# EAGLE design esp32_adapter_05 (EAGLE 7.7.0)
MaxAir - Smart Heating, Ventilation and Air Conditioning (HVAC) Wi-Fi Smart Home Gateway based on MySensors library WT21ETH01 and nRF24L01 PA LNA Note: Power supplied by Barrel Jack connector with minimum 2amp for better performance. Power by micro USB isnt avaialble in this version. For more information on PiHome Smart Heating: http://www.pihome.eu
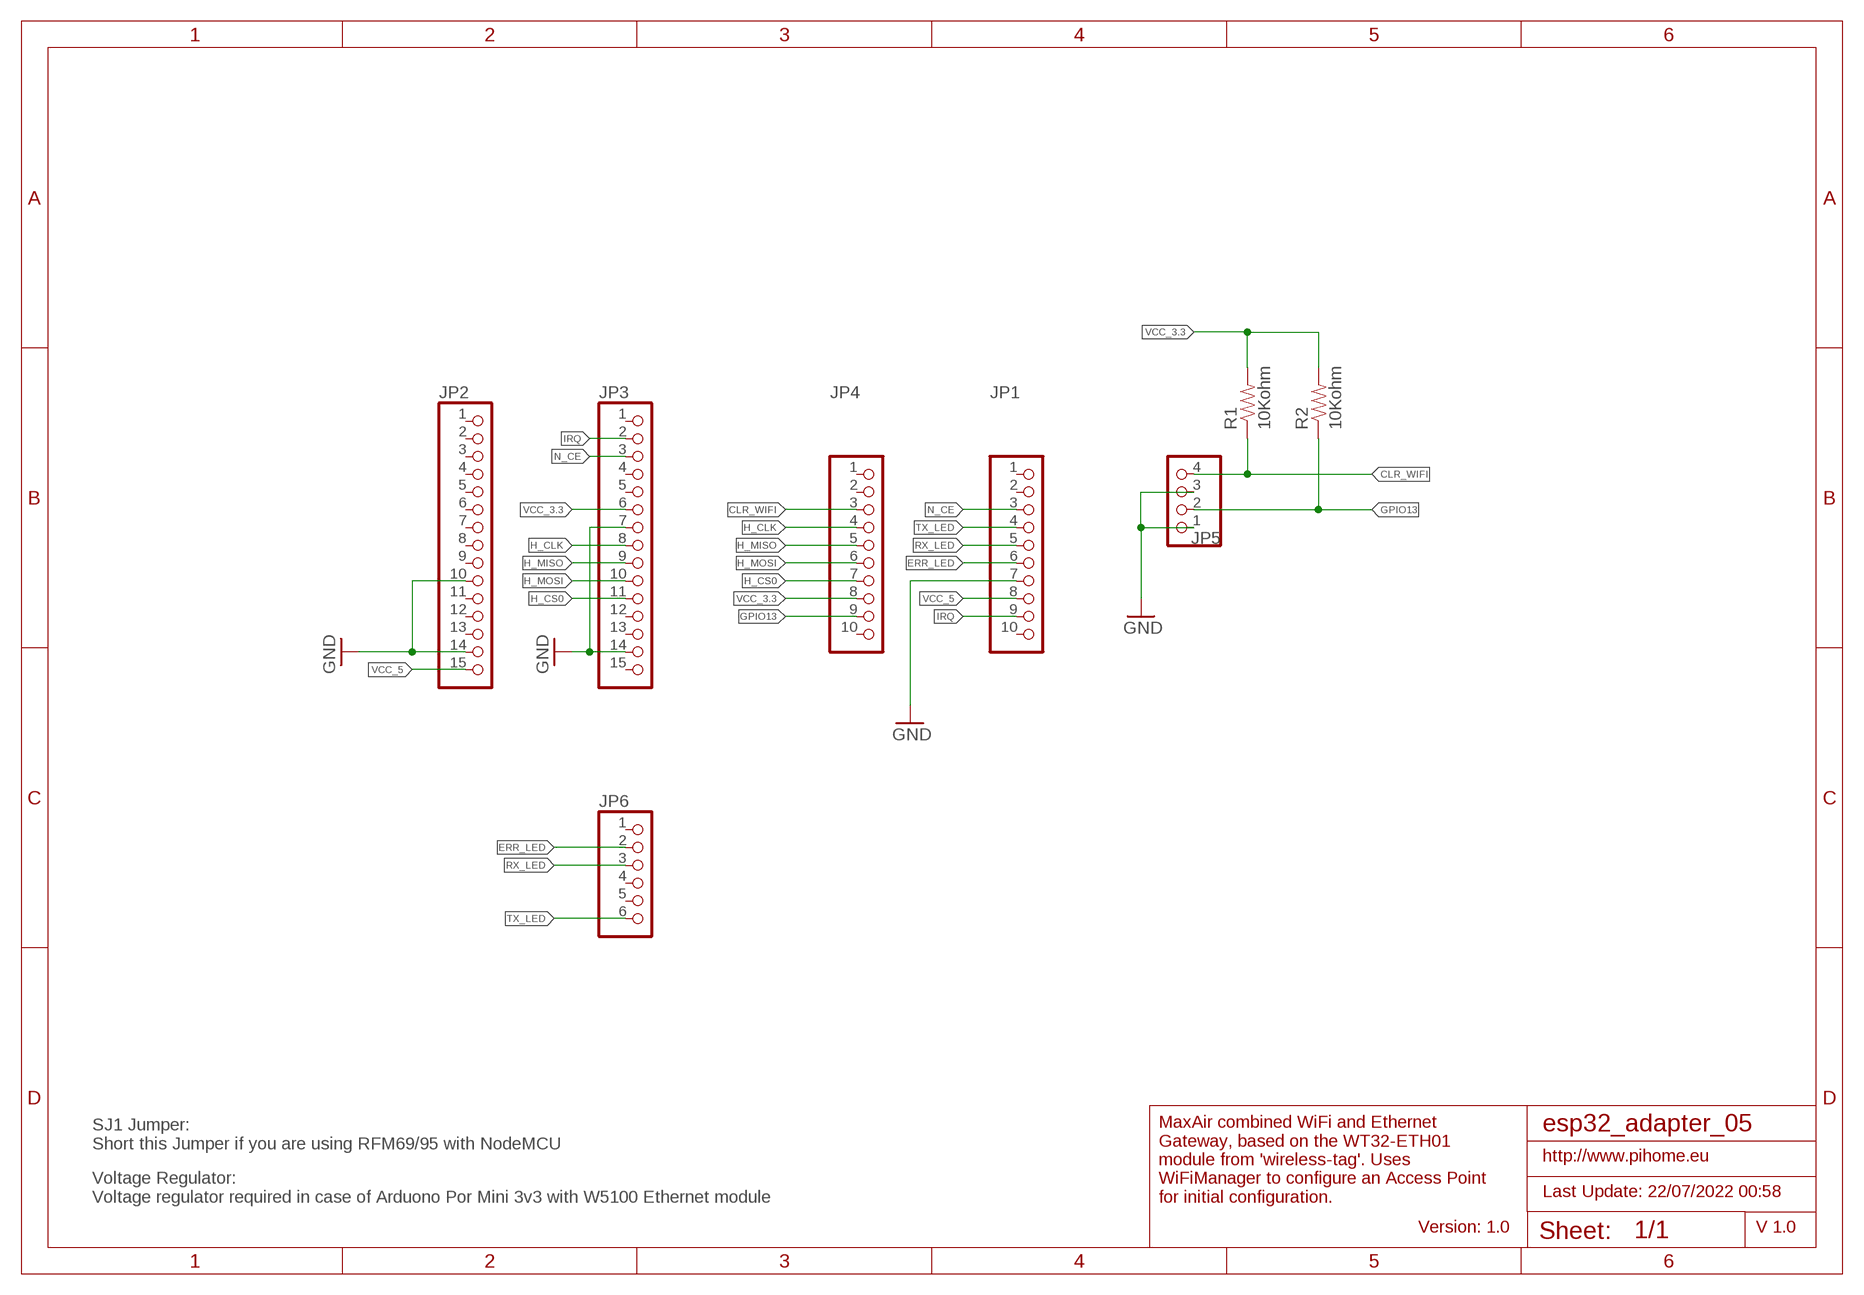
[diagram p0: schematic, sheet 1]

## Parts
JP1  PINHD-1X10  [1X10-BIG]
JP2  PINHD-1X15-CB  [1X15-CB]
JP3  PINHD-1X15-CB  [1X15-CB]
JP4  PINHD-1X10  [1X10-BIG]
JP5  PINHD-1X4/90  [1X04/90]
JP6  PINHD-1X6CLEAN  [1X06-CLEAN]
R1  10Kohm  RESISTORAXIAL-0.3  [AXIAL-0.3]
R2  10Kohm  RESISTORAXIAL-0.3  [AXIAL-0.3]

## Nets
CLR_WIFI: JP4.3 JP5.4 R1.P$1
ERR_LED: JP1.6 JP6.2
GND: JP1.7 JP2.10 JP2.14 JP3.7 JP3.14 JP5.1 JP5.3
GPIO13: JP4.9 JP5.2 R2.P$1
H_CLK: JP3.8 JP4.4
H_CS0: JP3.11 JP4.7
H_MISO: JP3.9 JP4.5
H_MOSI: JP3.10 JP4.6
IRQ: JP1.9 JP3.2
N_CE: JP1.3 JP3.3
RX_LED: JP1.5 JP6.3
TX_LED: JP1.4 JP6.6
VCC_3.3: JP3.6 JP4.8 R1.P$2 R2.P$2
VCC_5: JP1.8 JP2.15
Unconnected: JP1.1 JP1.2 JP1.10 JP2.1 JP2.2 JP2.3 JP2.4 JP2.5 JP2.6 JP2.7 JP2.8 JP2.9 JP2.11 JP2.12 JP2.13 JP3.1 JP3.4 JP3.5 JP3.12 JP3.13 JP3.15 JP4.1 JP4.2 JP4.10 JP6.1 JP6.4 JP6.5

## Notes on the sheet
- SJ1 Jumper:
  Short this Jumper if you are using RFM69/95 with NodeMCU
- http://www.pihome.eu
- Last Update: 22/07/2022 00:58
- Voltage Regulator:
  Voltage regulator required in case of Arduono Por Mini 3v3 with W5100 Ethernet module
- MaxAir combined WiFi and Ethernet
  Gateway, based on the WT32-ETH01
  module from 'wireless-tag'. Uses
  WiFiManager to configure an Access Point
  for initial configuration.
- Version: 1.0 | V 1.0

## Library data of the parts
JP1 JP4 = adafruit@1:PINHD-1X10: Pin header 1x10 0.1" spacing With round pins
JP2 JP3 = adafruit:PINHD-1X15: PIN HEADER
JP5 = pinhead:PINHD-1X4: PIN HEADER
JP6 = adafruit@1:PINHD-1X6: PIN HEADER
R1 R2 = SparkFun-Passives:RESISTOR: Resistor Basic schematic elements and footprints for 0603, 1206, and PTH resistors.

## Net classes
0 default: width 0.254 mm, drill 0.076 mm, clearance 0.205 mm

## Board
MaxAir - Smart Heating, Ventilation and Air Conditioning (HVAC) Wi-Fi Smart Home Gateway based on MySensors library WT21ETH01 and nRF24L01 PA LNA Note: Power supplied by Barrel Jack connector with minimum 2amp for better performance. Power by micro USB isnt avaialble in this version. For more information on PiHome Smart Heating: http://www.pihome.eu
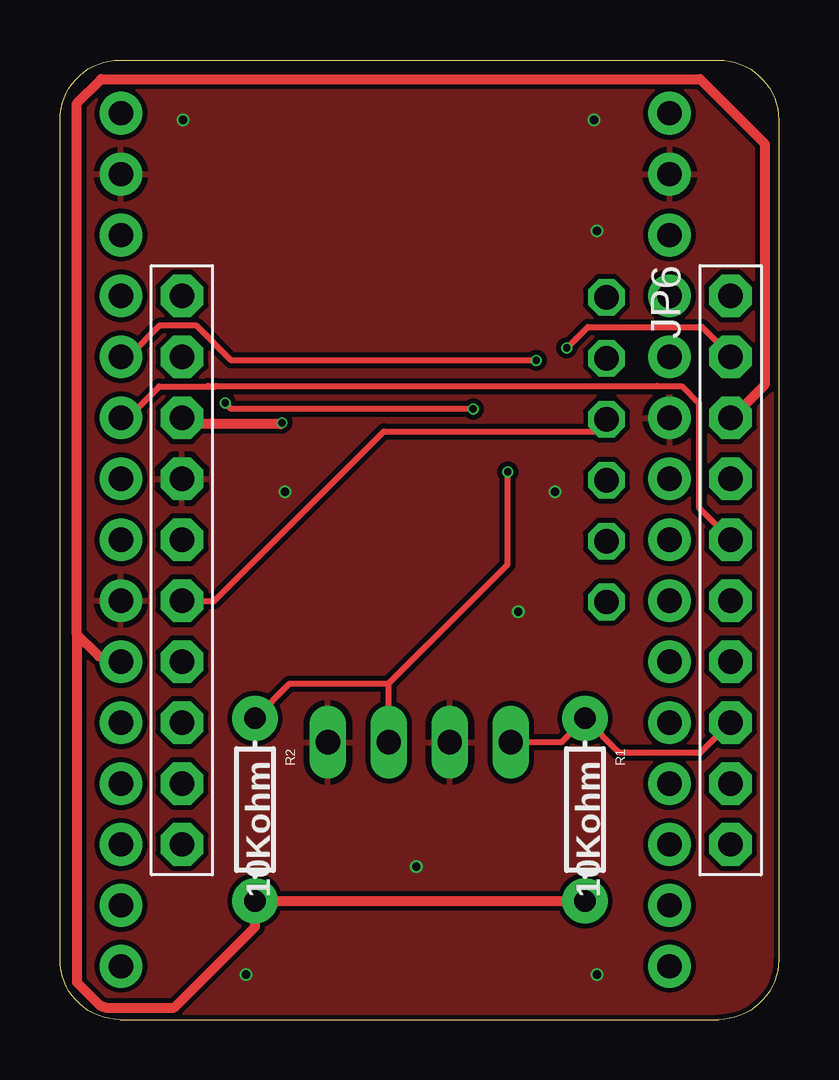
[diagram p1: board, top side]
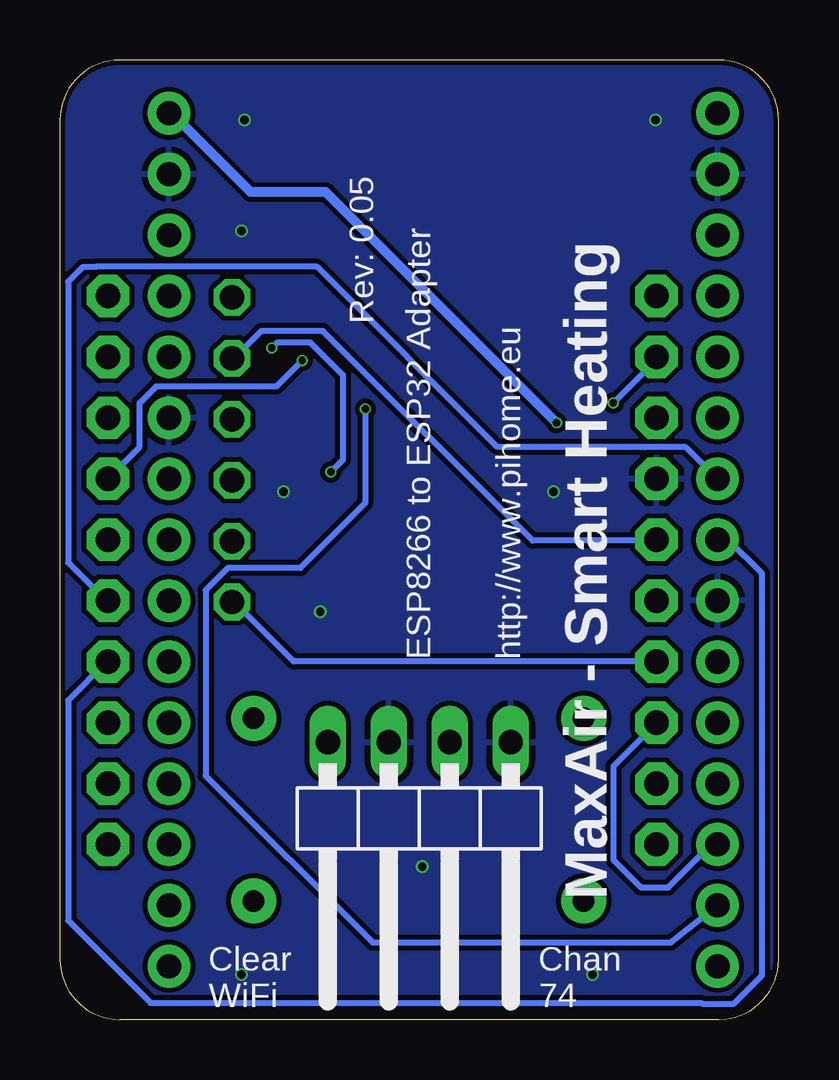
[diagram p2: board, bottom side, seen from below]

Size 29.94 x 40 mm. Coordinates in mm from the lower left corner, seen from the top.
Outline: 0,2.5 0,37.5 arc-90 2.5,40 27.44,40 arc-90 29.94,37.5 29.94,2.5 arc-90 27.44,0 2.5,0 arc-90 0,2.5
Copper layers (1*16): Top 0.035559375mm / dielectric 1.6mm / Bottom 0.035559375mm
Design rules "PiHome - JLCPCB 2 Layer": minimum track width 5mil, minimum drill 12mil, track to track 5mil, track to pad 5mil, pad to pad 5mil, via to via 5mil, smd to smd 5mil, copper to edge 8mil, drill to drill 6mil, minimum pad ring 5mil, minimum via ring 3mil, stop-mask expansion 2.5mil, vias tented up to drill 0mil, thermal gap 10mil

### Footprints (pad centres in the part's own frame; a part is rotated, then mirrored left to right if it is on the bottom)
1X10-BIG = drill 1.016 pad 1.778 octagon: 1 -11.43,0; 2 -8.89,0; 3 -6.35,0; 4 -3.81,0; 5 -1.27,0; 6 1.27,0; 7 3.81,0; 8 6.35,0; 9 8.89,0; 10 11.43,0
1X15-CB = drill 1.016 pad 1.778: 1 -17.78,0; 2 -15.24,0; 3 -12.7,0; 4 -10.16,0; 5 -7.62,0; 6 -5.08,0; 7 -2.54,0; 8 0,0; 9 2.54,0; 10 5.08,0; 11 7.62,0; 12 10.16,0; 13 12.7,0; 14 15.24,0; 15 17.78,0
1X04/90 = drill 1.016 long: 1 -3.81,-3.81; 2 -1.27,-3.81; 3 1.27,-3.81; 4 3.81,-3.81
1X06-CLEAN = drill 1.016 octagon: 1 -6.35,0; 2 -3.81,0; 3 -1.27,0; 4 1.27,0; 5 3.81,0; 6 6.35,0
AXIAL-0.3 = drill 0.9 pad 1.88: P$1 -3.81,0; P$2 3.81,0

### Placement (x,y rotation side)
JP1  5.08,18.73 90 top
JP2  25.4,20 90 top
JP3  2.54,20 90 top
JP4  27.94,18.73 90 top
JP5  14.97,7.75 180 bottom
JP6  22.77,23.75 270 top
R1  21.88,8.75 270 top
R2  8.12,8.75 270 top

### Tracks (layer width: path | path; a pad name or v marks a point on that pad's centre or on a via)
CLR_WIFI
  Top 0.254: JP4.3 26.68,11.12 23.31,11.12 R1.P$1 20.88,11.56 JP5.4
ERR_LED
  Bottom 0.254: JP6.2 22.72,27.77 22.49,27.77 21.55,28.71 18.99,28.71 10.24,19.97 5.28,19.97 JP1.6
GND  (via drill 0.35)
  other vias: 19.09,17 5.12,37.5 22.25,37.5 7.75,1.88 22.38,1.88 20.62,22 9.38,22 14.85,6.38 22.38,32.88
  pour Top: 0.25,0.25 0.25,39.75 29.69,39.75 29.69,0.25
  pour Bottom: 0.25,0.25 29.69,0.25 29.69,39.75 0.25,39.75
GPIO13  (via drill 0.3)
  Top 0.254: v18.65,22.83 18.65,18.96 13.7,14.01 | JP4.9 27.94,27.68 26.75,28.88 21.99,28.88 v21.11,28 | JP5.2 13.7,14.01 | R2.P$1 9.57,14.01 13.7,14.01
  Bottom 0.254: v21.11,28 20.88,28.23 19.51,28.23 18.15,26.87 18.15,23.33 v18.65,22.83
H_CLK
  Bottom 0.254: JP3.8 2.52,19.97 2.07,19.97 0.69,18.59 0.69,1.84 1.86,0.67 3.19,0.67 3.21,0.69 26.16,0.69 29.61,4.13 29.61,13.31 28,14.92 JP4.4
H_CS0  (via drill 0.3)
  Top 0.254: v19.84,27.48 7.14,27.48 5.7,28.92 4.13,28.92 2.98,27.77 2.75,27.77 JP3.11
  Bottom 0.254: JP4.7 27.77,22.72 26.62,23.87 26.62,25.7 25.93,26.39 20.93,26.39 v19.84,27.48
H_MISO
  Bottom 0.254: JP4.5 28,17.44 29.61,19.05 29.61,30.75 28.98,31.38 28.45,31.38 19.22,31.38 11.72,23.88 5.6,23.88 5.59,23.86 3.86,23.86 JP3.9
H_MOSI
  Top 0.254: 6.18,26.41 6.5,26.41 | JP3.10 2.75,25.25 2.98,25.25 4.13,26.39 6.48,26.39 6.5,26.41 | JP4.6 27.77,20.2 26.62,21.34 26.62,25.7 25.93,26.4 24.89,26.4 24.88,26.41 6.5,26.41
IRQ  (via drill 0.3)
  Top 0.254: v17.21,25.45 7.13,25.45 v6.88,25.7
  Bottom 0.254: v17.21,25.45 17.21,21.53 19.93,18.82 22.95,18.82 23.87,17.9 23.87,10.16 16.92,3.21 4.49,3.21 JP3.2 | v6.88,25.7 5.05,27.54 JP1.9
N_CE
  Bottom 0.254: JP3.3 2.75,7.11 2.98,7.11 4.59,5.51 5.74,5.51 6.88,6.66 6.88,10.56 5.28,12.16 JP1.3
RX_LED
  Top 0.254: JP1.5 5.28,17.44 6.43,17.44 13.5,24.52 22.26,24.52 JP6.3
TX_LED
  Bottom 0.254: JP6.6 22.72,17.21 22.49,17.21 20.2,14.92 5.28,14.92 JP1.4
VCC_3.3
  Top 0.254: 1.61,15.15 1.84,15.15
  Top 0.406: 1.61,15.15 0.7,16.05 | 1.84,15.15 JP3.6 | 0.7,16.05 0.7,38.19 1.71,39.2 26.67,39.2 29.36,36.51 29.36,26.46 27.98,25.08 JP4.8 | 0.7,16.05 0.7,1.55 1.66,0.59 1.78,0.53 1.91,0.5 4.75,0.5 8.12,3.88 R2.P$2 R1.P$2
VCC_5  (via drill 0.3)
  Top 0.406: JP1.8 5.34,24.82 9.19,24.82 v9.25,24.88
  Bottom 0.406: v9.25,24.88 18.88,34.5 22,34.5 25.28,37.78 JP2.15

### Text on the board
bPlace: Rev: 0.05 | http://www.pihome.eu | ESP8266 to ESP32 Adapter | MaxAir - Smart Heating | Chan / 74 | Clear / WiFi